# Altium project AD9959.PrjPcb
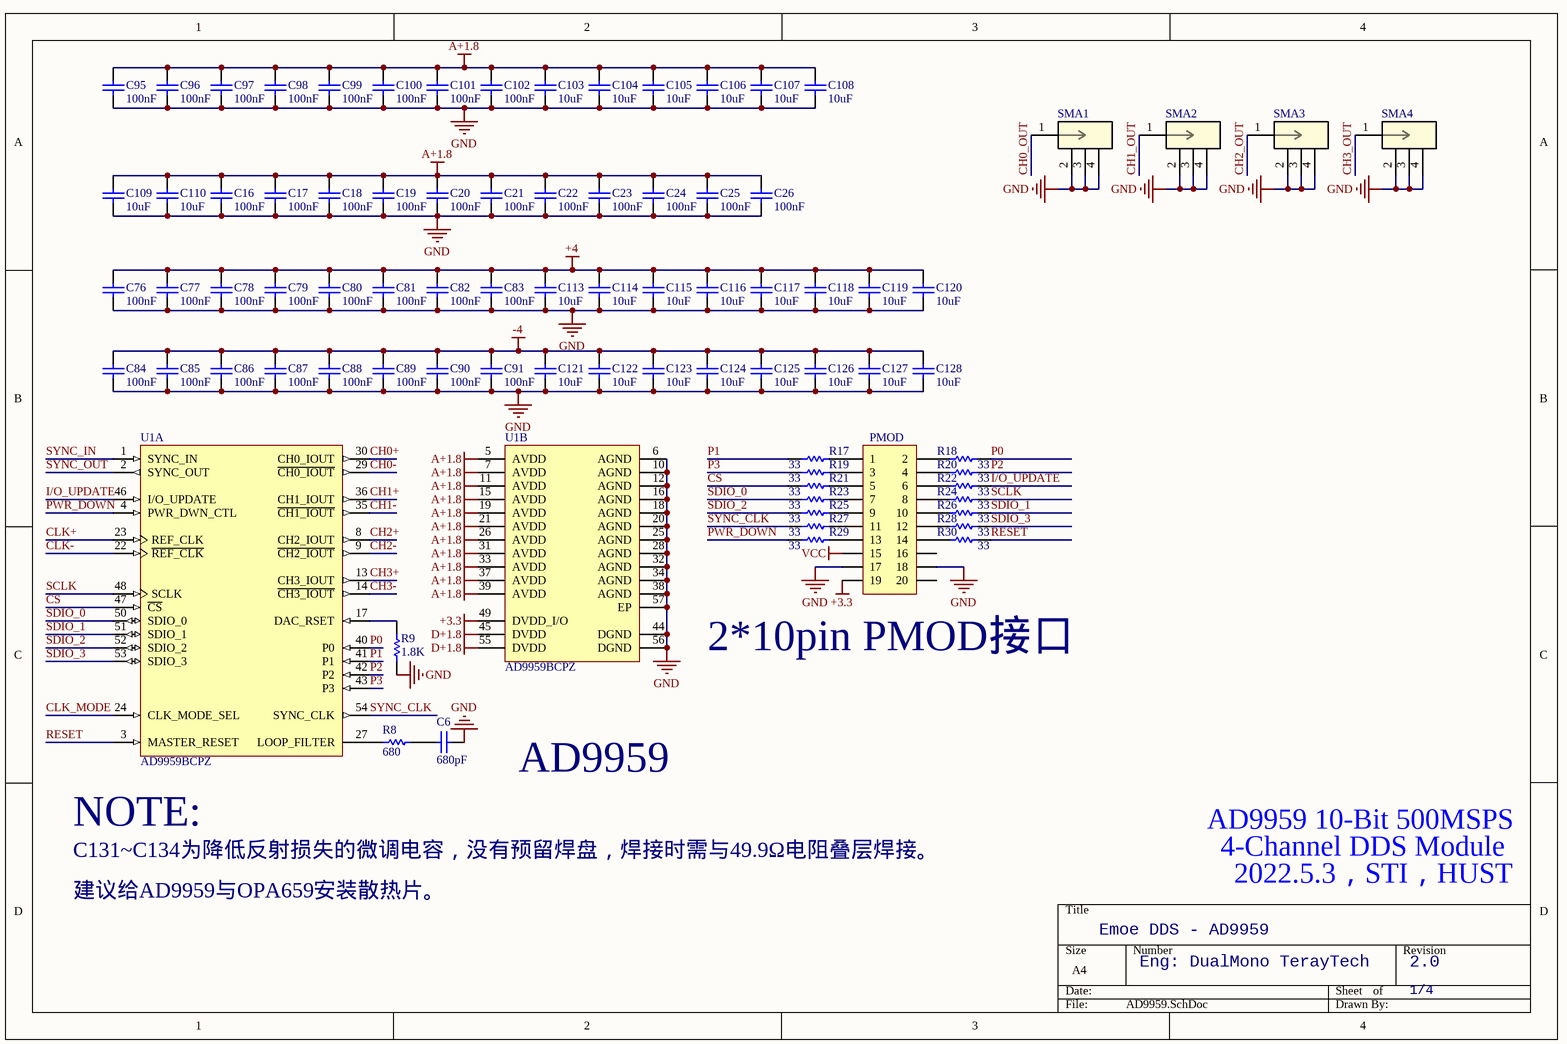
[diagram p0: AD9959.SchDoc]
4 sheets, 274 parts. Net scope: global (net labels, ports and power ports of the same name join across sheets).
Board file: AD9959.PcbDoc
Sheets:
  AD9959.SchDoc
  buffer.SchDoc
  CLOCKING.SchDoc
  power_fix.SchDoc

## Sheet AD9959.SchDoc: AD9959 4-Channel 500M DDS Module
size A4; Date: 2022.4.26; ApprovedBy: Pablo; CheckedBy: Pablo; Author: Pablo; CompanyName: STI; DrawnBy: Pablo; Engineer: Pablo; Organization: STI; DocumentNumber: 1; Revision: 1; SheetNumber: 1; SheetTotal: 4; Time: 2022.4.26

### Parts
C6  680pF  [0402]
C16  100nF  [0402]
C17  100nF  [0402]
C18  100nF  [0402]
C19  100nF  [0402]
C20  100nF  [0402]
C21  100nF  [0402]
C22  100nF  [0402]
C23  100nF  [0402]
C24  100nF  [0402]
C25  100nF  [0402]
C26  100nF  [0402]
C76  100nF  [0402]
C77  100nF  [0402]
C78  100nF  [0402]
C79  100nF  [0402]
C80  100nF  [0402]
C81  100nF  [0402]
C82  100nF  [0402]
C83  100nF  [0402]
C84  100nF  [0402]
C85  100nF  [0402]
C86  100nF  [0402]
C87  100nF  [0402]
C88  100nF  [0402]
C89  100nF  [0402]
C90  100nF  [0402]
C91  100nF  [0402]
C95  100nF  [0402]
C96  100nF  [0402]
C97  100nF  [0402]
C98  100nF  [0402]
C99  100nF  [0402]
C100  100nF  [0402]
C101  100nF  [0402]
C102  100nF  [0402]
C103  10uF  [0402]
C104  10uF  [0402]
C105  10uF  [0402]
C106  10uF  [0402]
C107  10uF  [0402]
C108  10uF  [0402]
C109  10uF  [0402]
C110  10uF  [0402]
C113  10uF  [0402]
C114  10uF  [0402]
C115  10uF  [0402]
C116  10uF  [0402]
C117  10uF  [0402]
C118  10uF  [0402]
C119  10uF  [0402]
C120  10uF  [0402]
C121  10uF  [0402]
C122  10uF  [0402]
C123  10uF  [0402]
C124  10uF  [0402]
C125  10uF  [0402]
C126  10uF  [0402]
C127  10uF  [0402]
C128  10uF  [0402]
PMOD  Header 2X10  [201R2X10]  (value not drawn)
R8  680  [0402]
R9  1.8K  [0402]
R17  33  [0402]
R18  33  [0402]
R19  33  [0402]
R20  33  [0402]
R21  33  [0402]
R22  33  [0402]
R23  33  [0402]
R24  33  [0402]
R25  33  [0402]
R26  33  [0402]
R27  33  [0402]
R28  33  [0402]
R29  33  [0402]
R30  33  [0402]
SMA1  132414  [CONN_132414_AMP]  (value not drawn)
SMA2  132414  [CONN_132414_AMP]  (value not drawn)
SMA3  132414  [CONN_132414_AMP]  (value not drawn)
SMA4  132414  [CONN_132414_AMP]  (value not drawn)
U1  AD9959BCPZ  [ADI-CP-56-1_L]  (parts A,B of 2)

### Nets
+3.3: PMOD.19 U1.49(DVDD_I/O)
+4: C76.1 C77.1 C78.1 C79.1 C80.1 C81.1 C82.1 C83.1 C113.1 C114.1 C115.1 C116.1 C117.1 C118.1 C119.1 C120.1
-4: C84.1 C85.1 C86.1 C87.1 C88.1 C89.1 C90.1 C91.1 C121.1 C122.1 C123.1 C124.1 C125.1 C126.1 C127.1 C128.1
A+1.8: C16.1 C17.1 C18.1 C19.1 C20.1 C21.1 C22.1 C23.1 C24.1 C25.1 C26.1 C95.1 C96.1 C97.1 C98.1 C99.1 C100.1 C101.1 C102.1 C103.1 C104.1 C105.1 C106.1 C107.1 C108.1 C109.1 C110.1 U1.5(AVDD) U1.7(AVDD) U1.11(AVDD) U1.15(AVDD) U1.19(AVDD) U1.21(AVDD) U1.26(AVDD) U1.31(AVDD) U1.33(AVDD) U1.37(AVDD) U1.39(AVDD)
D+1.8: U1.45(DVDD) U1.55(DVDD)
GND: C6.1 C16.2 C17.2 C18.2 C19.2 C20.2 C21.2 C22.2 C23.2 C24.2 C25.2 C26.2 C76.2 C77.2 C78.2 C79.2 C80.2 C81.2 C82.2 C83.2 C84.2 C85.2 C86.2 C87.2 C88.2 C89.2 C90.2 C91.2 C95.2 C96.2 C97.2 C98.2 C99.2 C100.2 C101.2 C102.2 C103.2 C104.2 C105.2 C106.2 C107.2 C108.2 C109.2 C110.2 C113.2 C114.2 C115.2 C116.2 C117.2 C118.2 C119.2 C120.2 C121.2 C122.2 C123.2 C124.2 C125.2 C126.2 C127.2 C128.2 PMOD.17 PMOD.18 R9.2 SMA1.2 SMA1.3 SMA1.4 SMA2.2 SMA2.3 SMA2.4 SMA3.2 SMA3.3 SMA3.4 SMA4.2 SMA4.3 SMA4.4 U1.6(AGND) U1.10(AGND) U1.12(AGND) U1.16(AGND) U1.18(AGND) U1.20(AGND) U1.25(AGND) U1.28(AGND) U1.32(AGND) U1.34(AGND) U1.38(AGND) U1.44(DGND) U1.56(DGND) U1.57(EP)
VCC: PMOD.15
CH0+: U1.30(CH0_IOUT)
CH0-: U1.29(~{CH0_IOUT})
CH0_OUT: SMA1.1
CH1+: U1.36(CH1_IOUT)
CH1-: U1.35(~{CH1_IOUT})
CH1_OUT: SMA2.1
CH2+: U1.8(CH2_IOUT)
CH2-: U1.9(~{CH2_IOUT})
CH2_OUT: SMA3.1
CH3+: U1.13(CH3_IOUT)
CH3-: U1.14(~{CH3_IOUT})
CH3_OUT: SMA4.1
CLK+: U1.23(REF_CLK)
CLK-: U1.22(~{REF_CLK})
CLK_MODE: U1.24(CLK_MODE_SEL)
CS: R21.2 U1.47(~{CS})
I/O_UPDATE: R22.1 U1.46(I/O_UPDATE)
P0: R18.1 U1.40(P0)
P1: R17.2 U1.41(P1)
P2: R20.1 U1.42(P2)
P3: R19.2 U1.43(P3)
PWR_DOWN: R29.2 U1.4(PWR_DWN_CTL)
RESET: R30.1 U1.3(MASTER_RESET)
SCLK: R24.1 U1.48(SCLK)
SDIO_0: R23.2 U1.50(SDIO_0)
SDIO_1: R26.1 U1.51(SDIO_1)
SDIO_2: R25.2 U1.52(SDIO_2)
SDIO_3: R28.1 U1.53(SDIO_3)
SYNC_CLK: R27.2 U1.54(SYNC_CLK)
SYNC_IN: U1.1(SYNC_IN)
SYNC_OUT: U1.2(SYNC_OUT)
NetC6_2: C6.2 R8.2
NetPMOD_1: PMOD.1 R17.1
NetPMOD_2: PMOD.2 R18.2
NetPMOD_3: PMOD.3 R19.1
NetPMOD_4: PMOD.4 R20.2
NetPMOD_5: PMOD.5 R21.1
NetPMOD_6: PMOD.6 R22.2
NetPMOD_7: PMOD.7 R23.1
NetPMOD_8: PMOD.8 R24.2
NetPMOD_9: PMOD.9 R25.1
NetPMOD_10: PMOD.10 R26.2
NetPMOD_11: PMOD.11 R27.1
NetPMOD_12: PMOD.12 R28.2
NetPMOD_13: PMOD.13 R29.1
NetPMOD_14: PMOD.14 R30.2
NetR8_1: R8.1 U1.27(LOOP_FILTER)
NetR9_1: R9.1 U1.17(DAC_RSET)

Not connected (* = marked no-connect by the designer): PMOD 16 20

### Notes on the sheet
- (near PMOD) 2*10pin PMOD接口
- AD9959
- (near U1) NOTE:
- C131~C134为降低反射损失的微调电容，没有预留焊盘，焊接时需与49.9Ω电阻叠层焊接。
- AD9959 10-Bit 500MSPS
- 4-Channel DDS Module
- 建议给AD9959与OPA659安装散热片。
- Emoe DDS - AD9959
- 2022.5.3，STI，HUST
- Eng: DualMono TerayTech
- 2.0
- 1/4
- Title:
- Size:
- Date:
- A4
- No.:
- Sheet           of
- Revision:
- Author:
- File:

### Library data of the parts
C6 C16-C26 C76-C91 C95-C110 C113-C128 = CAP: Capacitor; Value: 104; Published: 8-Jun-2000; LatestRevisionDate: 17-Jul-2002; LatestRevisionNote: Re-released for DXP Platform.; PackageReference: RAD-0.3; Publisher: Altium Limited
PMOD = Header 10X2: 10*2P接插件; 淘宝ID: 小糖豆的小窝窝; BOM名称: 10*2P接插件; 下单链接: https://item.taobao.com/item.htm?ft=t&id=613637044352
R8 R9 R17-R30 = RES: Resistor; Value: 1K; Published: 8-Jun-2000; Revision: July-2002: Re-released for DXP Platform.; Publisher: Altium Limited
SMA1-SMA4 = 132414: No Description Available; Mfr_Name: Amphenol ICC; Copyright: Copyright (C) 2022 Ultra Librarian. All rights reserved.; Manufacturer_Part_Number: 132414; RefDes: RefDes; Type: DEV
U1 = CMP-0293-00014-1: 4-Channel, 500 MSPS DDS with 10-Bit DACs, Serial, CP-56-1, 260 Tray, Pb-Free; Tuning Word Width (bits): 32bit; Master fclk: 500MHz; Compliance Range (V): 2.3V; FS Iout (mA nom): 10mA; REFCLK Multiplier: Yes; I Supply total (max): 180mA; Resolution (Bits): 10bit; ComponentLink3URL: http://www.analog.com/static/imported-files/packages/32698137492825CP_56_1.pdf; PackageDescription: 56-Lead Lead Frame Chip Scale Package [LFCSP_VQ]; DatasheetVersion: Rev. B; ComponentLink1URL: www.analog.com; PackageVersion: 112805-0; ComponentLink1Description: Manufacturer URL; ComponentLink2Description: Datasheet; Code_JEDEC: MO-220-VLLD-2; ComponentLink2URL: http://www.analog.com/static/imported-files/data_sheets/AD9959.pdf; PackageReference: CP-56-1; I/O Interface: Serial; ComponentLink3Description: Package Specification

## Sheet buffer.SchDoc
size A4; SheetNumber: 2; SheetTotal: 4
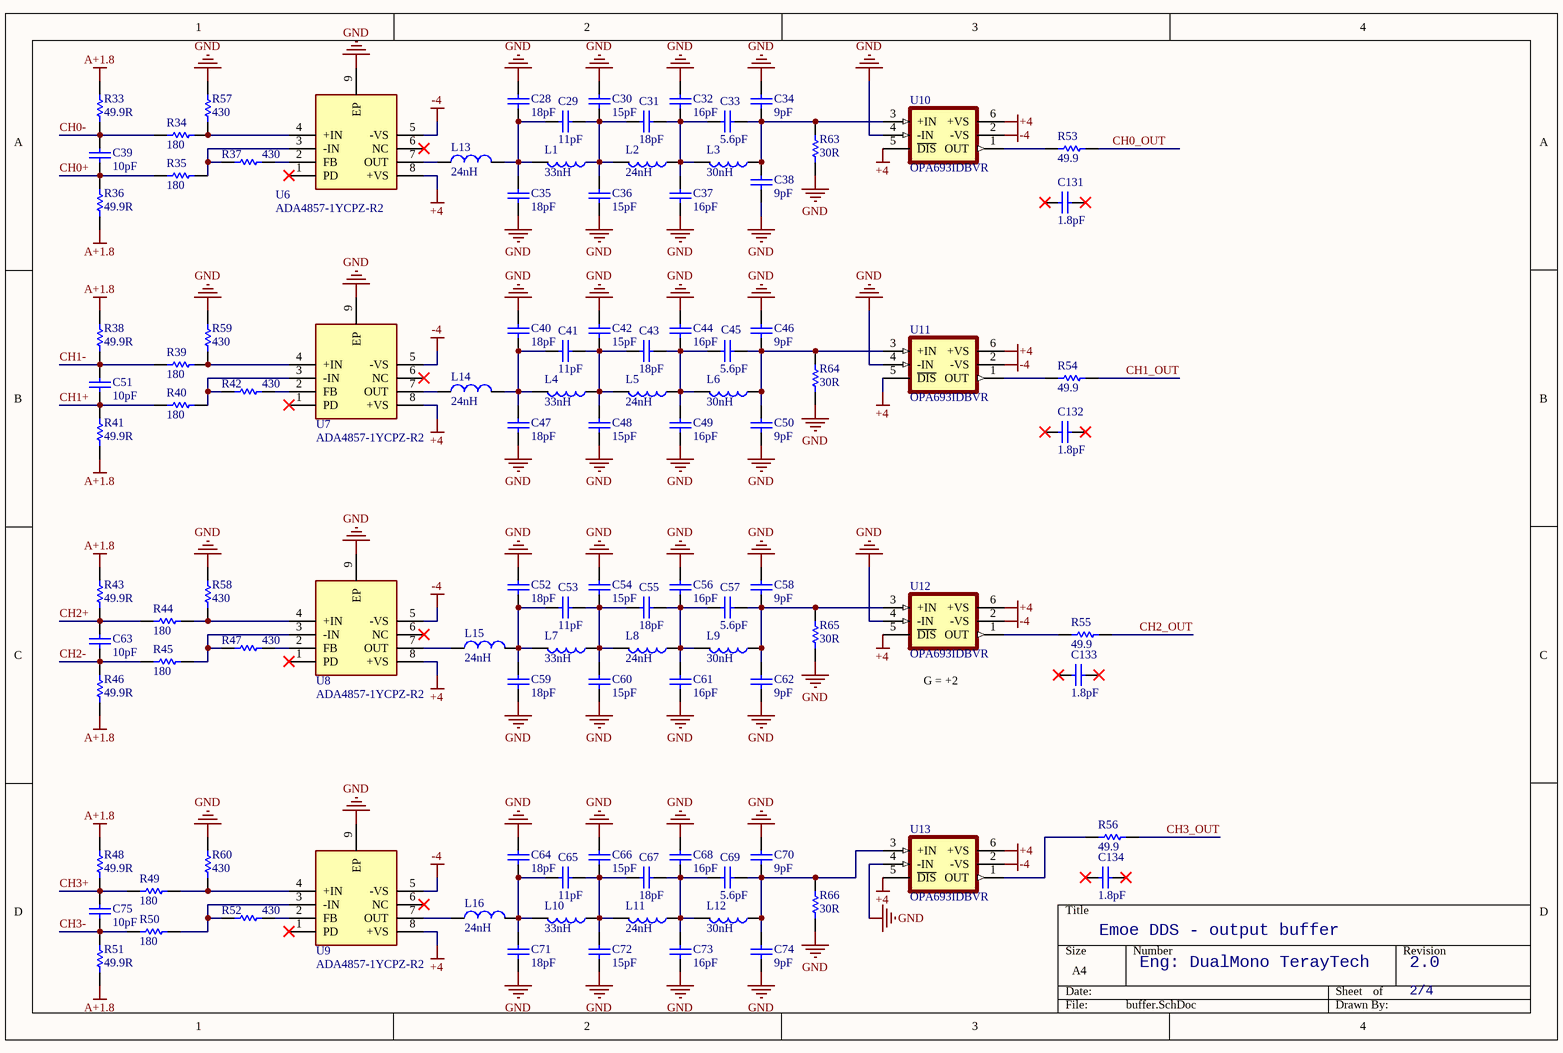
[diagram p1: buffer.SchDoc]

### Parts
C28  18pF  [0402]
C29  11pF  [0402]
C30  15pF  [0402]
C31  18pF  [0402]
C32  16pF  [0402]
C33  5.6pF  [0402]
C34  9pF  [0402]
C35  18pF  [0402]
C36  15pF  [0402]
C37  16pF  [0402]
C38  9pF  [0402]
C39  10pF  [0402]
C40  18pF  [0402]
C41  11pF  [0402]
C42  15pF  [0402]
C43  18pF  [0402]
C44  16pF  [0402]
C45  5.6pF  [0402]
C46  9pF  [0402]
C47  18pF  [0402]
C48  15pF  [0402]
C49  16pF  [0402]
C50  9pF  [0402]
C51  10pF  [0402]
C52  18pF  [0402]
C53  11pF  [0402]
C54  15pF  [0402]
C55  18pF  [0402]
C56  16pF  [0402]
C57  5.6pF  [0402]
C58  9pF  [0402]
C59  18pF  [0402]
C60  15pF  [0402]
C61  16pF  [0402]
C62  9pF  [0402]
C63  10pF  [0402]
C64  18pF  [0402]
C65  11pF  [0402]
C66  15pF  [0402]
C67  18pF  [0402]
C68  16pF  [0402]
C69  5.6pF  [0402]
C70  9pF  [0402]
C71  18pF  [0402]
C72  15pF  [0402]
C73  16pF  [0402]
C74  9pF  [0402]
C75  10pF  [0402]
C131  1.8pF  [0402]
C132  1.8pF  [0402]
C133  1.8pF  [0402]
C134  1.8pF  [0402]
L1  33nH  [0402]
L2  24nH  [0402]
L3  30nH  [0402]
L4  33nH  [0402]
L5  24nH  [0402]
L6  30nH  [0402]
L7  33nH  [0402]
L8  24nH  [0402]
L9  30nH  [0402]
L10  33nH  [0402]
L11  24nH  [0402]
L12  30nH  [0402]
L13  24nH  [0402L]
L14  24nH  [0402L]
L15  24nH  [0402L]
L16  24nH  [0402L]
R33  49.9R  [0402]
R34  180  [0402]
R35  180  [0402]
R36  49.9R  [0402]
R37  430  [0402]
R38  49.9R  [0402]
R39  180  [0402]
R40  180  [0402]
R41  49.9R  [0402]
R42  430  [0402]
R43  49.9R  [0402]
R44  180  [0402]
R45  180  [0402]
R46  49.9R  [0402]
R47  430  [0402]
R48  49.9R  [0402]
R49  180  [0402]
R50  180  [0402]
R51  49.9R  [0402]
R52  430  [0402]
R53  49.9  [0603]
R54  49.9  [0603]
R55  49.9  [0603]
R56  49.9  [0603]
R57  430  [0402]
R58  430  [0402]
R59  430  [0402]
R60  430  [0402]
R63  30R  [0402L]
R64  30R  [0402L]
R65  30R  [0402L]
R66  30R  [0402L]
U6  ADA4857-1YCPZ-R2  [SON50P300X300X85-9N-D]
U7  ADA4857-1YCPZ-R2  [SON50P300X300X85-9N-D]
U8  ADA4857-1YCPZ-R2  [SON50P300X300X85-9N-D]
U9  ADA4857-1YCPZ-R2  [SON50P300X300X85-9N-D]
U10  OPA693IDBVR  [SOT95P280X145-6N]
U11  OPA693IDBVR  [SOT95P280X145-6N]
U12  OPA693IDBVR  [SOT95P280X145-6N]
U13  OPA693IDBVR  [SOT95P280X145-6N]

### Nets
+4: U6.8(+VS) U7.8(+VS) U8.8(+VS) U9.8(+VS) U10.5(~{DIS}) U10.6(+VS) U11.5(~{DIS}) U11.6(+VS) U12.5(~{DIS}) U12.6(+VS) U13.5(~{DIS}) U13.6(+VS)
-4: U6.5(-VS) U7.5(-VS) U8.5(-VS) U9.5(-VS) U10.2(-VS) U11.2(-VS) U12.2(-VS) U13.2(-VS)
A+1.8: R33.1 R36.2 R38.1 R41.2 R43.1 R46.2 R48.1 R51.2
GND: C28.1 C30.1 C32.1 C34.2 C35.2 C36.2 C37.2 C38.1 C40.1 C42.1 C44.1 C46.2 C47.2 C48.2 C49.2 C50.1 C52.1 C54.1 C56.1 C58.2 C59.2 C60.2 C61.2 C62.1 C64.1 C66.1 C68.1 C70.2 C71.2 C72.2 C73.2 C74.1 R57.2 R58.2 R59.2 R60.2 R63.1 R64.1 R65.1 R66.1 U6.9(EP) U7.9(EP) U8.9(EP) U9.9(EP) U10.4(-IN) U11.4(-IN) U12.4(-IN) U13.4(-IN)
CH0+: C39.1 R35.1 R36.1
CH0-: C39.2 R33.2 R34.1
CH0_OUT: R53.2
CH1+: C51.1 R40.1 R41.1
CH1-: C51.2 R38.2 R39.1
CH1_OUT: R54.2
CH2+: C63.2 R43.2 R44.1
CH2-: C63.1 R45.1 R46.1
CH2_OUT: R55.2
CH3+: C75.2 R48.2 R49.1
CH3-: C75.1 R50.1 R51.1
CH3_OUT: R56.2
NetC28_2: C28.2 C29.1 C35.1 L1.2 L13.2
NetC29_2: C29.2 C30.2 C31.1 C36.1 L1.1 L2.2
NetC31_2: C31.2 C32.2 C33.1 C37.1 L2.1 L3.2
NetC33_2: C33.2 C34.1 C38.2 L3.1 R63.2 U10.3(+IN)
NetC40_2: C40.2 C41.1 C47.1 L4.2 L14.2
NetC41_2: C41.2 C42.2 C43.1 C48.1 L4.1 L5.2
NetC43_2: C43.2 C44.2 C45.1 C49.1 L5.1 L6.2
NetC45_2: C45.2 C46.1 C50.2 L6.1 R64.2 U11.3(+IN)
NetC52_2: C52.2 C53.1 C59.1 L7.2 L15.2
NetC53_2: C53.2 C54.2 C55.1 C60.1 L7.1 L8.2
NetC55_2: C55.2 C56.2 C57.1 C61.1 L8.1 L9.2
NetC57_2: C57.2 C58.1 C62.2 L9.1 R65.2 U12.3(+IN)
NetC64_2: C64.2 C65.1 C71.1 L10.2 L16.2
NetC65_2: C65.2 C66.2 C67.1 C72.1 L10.1 L11.2
NetC67_2: C67.2 C68.2 C69.1 C73.1 L11.1 L12.2
NetC69_2: C69.2 C70.1 C74.2 L12.1 R66.2 U13.3(+IN)
NetL13_1: L13.1 U6.7(OUT)
NetL14_1: L14.1 U7.7(OUT)
NetL15_1: L15.1 U8.7(OUT)
NetL16_1: L16.1 U9.7(OUT)
NetR34_2: R34.2 R57.1 U6.4(+IN)
NetR35_2: R35.2 R37.1 U6.3(-IN)
NetR37_2: R37.2 U6.2(FB)
NetR39_2: R39.2 R59.1 U7.4(+IN)
NetR40_2: R40.2 R42.1 U7.3(-IN)
NetR42_2: R42.2 U7.2(FB)
NetR44_2: R44.2 R58.1 U8.4(+IN)
NetR45_2: R45.2 R47.1 U8.3(-IN)
NetR47_2: R47.2 U8.2(FB)
NetR49_2: R49.2 R60.1 U9.4(+IN)
NetR50_2: R50.2 R52.1 U9.3(-IN)
NetR52_2: R52.2 U9.2(FB)
NetR53_1: R53.1 U10.1(OUT)
NetR54_1: R54.1 U11.1(OUT)
NetR55_1: R55.1 U12.1(OUT)
NetR56_1: R56.1 U13.1(OUT)

Not connected (* = marked no-connect by the designer): C131 1* 2*; C132 1* 2*; C133 1* 2*; C134 1* 2*; U6 1(PD)* 6(NC)*; U7 1(PD)* 6(NC)*; U8 1(PD)* 6(NC)*; U9 1(PD)* 6(NC)*

### Notes on the sheet
- (near U12) G = +2
- (near C134) Emoe DDS - output buffer
- Eng: DualMono TerayTech
- 2.0
- 2/4

### Library data of the parts
C28-C75 C131-C134 = CAP: Capacitor; Value: 104; Published: 8-Jun-2000; LatestRevisionDate: 17-Jul-2002; LatestRevisionNote: Re-released for DXP Platform.; PackageReference: RAD-0.3; Publisher: Altium Limited
L1-L12 = FB
L13-L16 = Inductor
R33-R60 R63-R66 = RES: Resistor; Value: 1K; Published: 8-Jun-2000; Revision: July-2002: Re-released for DXP Platform.; Publisher: Altium Limited
U6-U9 = ADA4857-1YCPZ-R2: Integrated Circuit; Manufacturer_Name: Analog Devices; Datasheet Link: https://g.componentsearchengine.com/Datasheets/1/ADA4857-1YCPZ-R2.pdf; Height: 0.85mm; Manufacturer_Part_Number: ADA4857-1YCPZ-R2; Mouser Part Number: 584-ADA4857-1YCPZ-R2; Mouser Price/Stock: http://www.mouser.com/Search/ProductDetail.aspx?qs=pqQDoYZ2quYEvaTEvq9xqQ%3d%3d
U10-U13 = OPA693IDBVR: Ultra-Wideband, Fixed Gain Video Buffer Amplifier with Disable; MF: Texas Instruments; Availability: In Stock; Package: SOT-23-6 Texas Instruments; MP: OPA693IDBVR; Value: *; Purchase-URL: https://pricing.snapeda.com/search/part/OPA693IDBVR/?ref=eda; SnapEDA_Link: https://www.snapeda.com/parts/OPA693IDBVR/Texas+Instruments/view-part/?ref=snap; Price: None; Check_prices: https://www.snapeda.com/parts/OPA693IDBVR/Texas+Instruments/view-part/?ref=eda

## Sheet CLOCKING.SchDoc
size A4; SheetNumber: 3; SheetTotal: 4
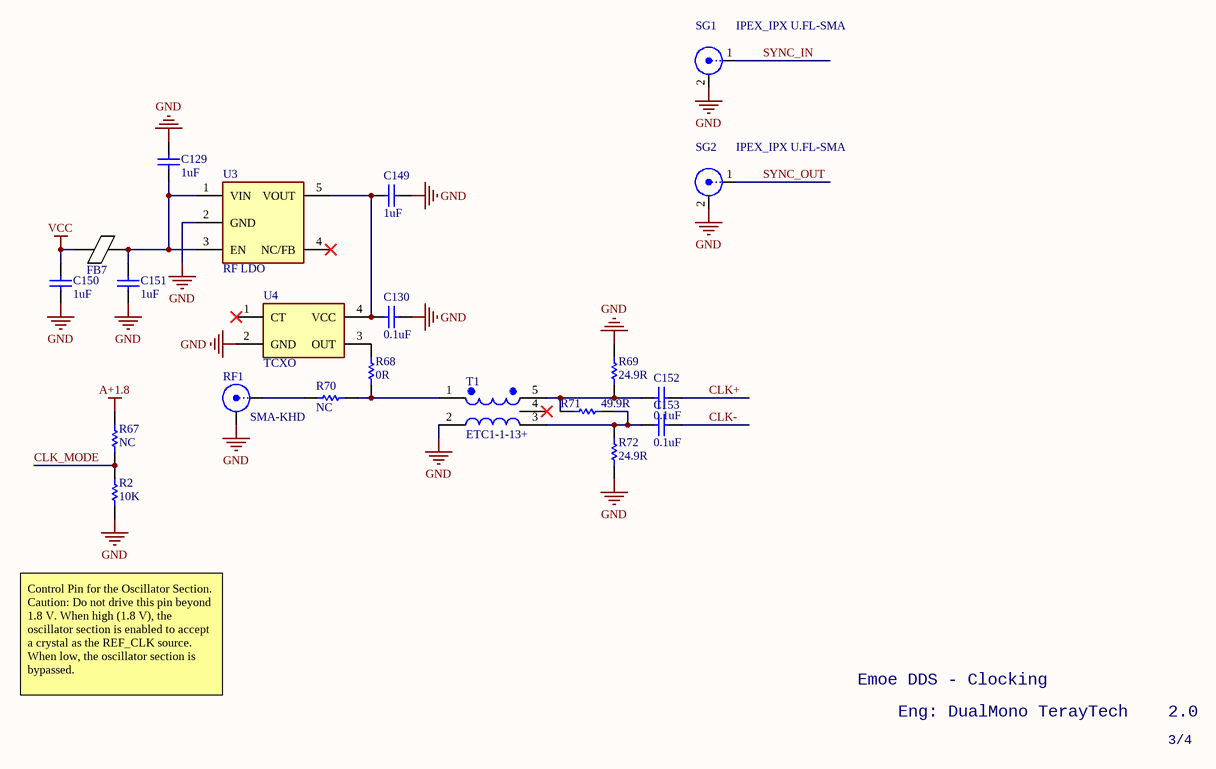
[diagram p2: CLOCKING.SchDoc]

### Parts
C129  1uF  [0603_C]
C130  0.1uF  [0402]
C149  1uF  [0603_C]
C150  1uF  [0603_C]
C151  1uF  [0603_C]
C152  0.1uF  [0402l]
C153  0.1uF  [0402l]
FB7  600Ω @ 100MHz  [0603]  (value not drawn)
R2  10K  [0402]
R67  NC  [0402L]
R68  0R  [0402]
R69  24.9R  [0402L]
R70  NC  [0402]
R71  49.9R  [0402L]
R72  24.9R  [0402L]
RF1  SMA-KHD  [SMA-5]
SG1  IPEX_IPX U.FL-SMA  [IPEX_gen1]
SG2  IPEX_IPX U.FL-SMA  [IPEX_gen1]
T1  ETC1-1-13+  [BALUN-5]
U3  RF LDO  [SOT-23-5]
U4  TCXO  [OSC_KH3225_4P]

### Nets
A+1.8: R67.1
GND: C129.1 C130.2 C149.1 C150.1 C151.1 R2.2 R69.1 R72.1 RF1.1 SG1.2(GND) SG2.2(GND) T1.2 U3.2(GND) U4.2(GND)
VCC: C150.2 FB7.1
CLK+: C152.2
CLK-: C153.2
CLK_MODE: R2.1 R67.2
SYNC_IN: SG1.1(X)
SYNC_OUT: SG2.1(X)
NetC129_2: C129.2 C151.2 FB7.2 U3.1(VIN) U3.3(EN)
NetC130_1: C130.1 C149.2 U3.5(VOUT) U4.4(VCC)
NetC152_1: C152.1 R69.2 R71.1 T1.5
NetC153_1: C153.1 R71.2 R72.2 T1.3
NetR68_1: R68.1 U4.3(OUT)
NetR68_2: R68.2 R70.2 T1.1
NetR70_1: R70.1 RF1.2

Not connected (* = marked no-connect by the designer): T1 4*; U3 4(NC/FB)*; U4 1(CT)*

### Notes on the sheet
- Emoe DDS - Clocking
- Control Pin for the Oscillator Section. Caution: Do not drive this pin beyond 1.8 V. When high (1.8 V), the oscillator section is enabled to accept a crystal as the REF_CLK source. When low, the oscillator section is bypassed.
- Eng: DualMono TerayTech
- 2.0
- 3/4

### Library data of the parts
C129 C130 C149-C153 = CAP: Capacitor; Value: 104; Published: 8-Jun-2000; LatestRevisionDate: 17-Jul-2002; LatestRevisionNote: Re-released for DXP Platform.; PackageReference: RAD-0.3; Publisher: Altium Limited
FB7 = FB: 磁珠 600Ω @ 100MHz
R2 R67-R72 = RES: Resistor; Value: 1K; Published: 8-Jun-2000; Revision: July-2002: Re-released for DXP Platform.; Publisher: Altium Limited
RF1 = SMA_KHD
T1 = ETC1-1-13
U3 = ADP150

## Sheet power_fix.SchDoc
size A4; SheetNumber: 4; SheetTotal: 4
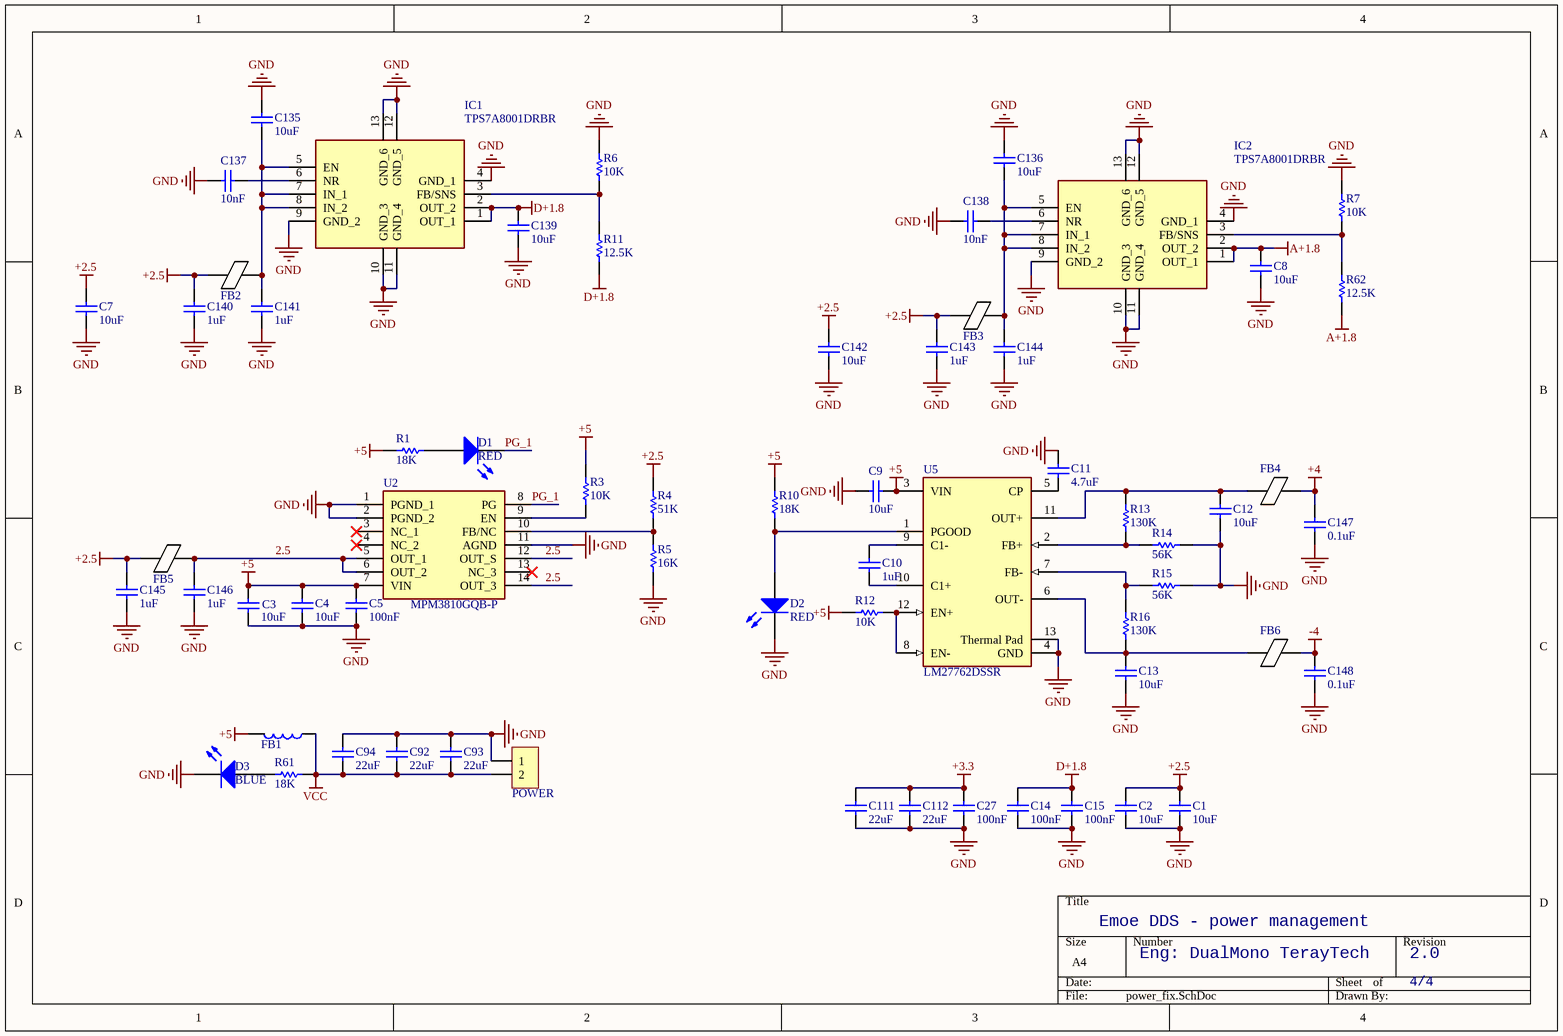
[diagram p3: power_fix.SchDoc]

### Parts
C1  10uF  [1608[0603]]
C2  10uF  [1608[0603]]
C3  10uF  [1608[0603]]
C4  10uF  [1608[0603]]
C5  100nF  [0402]
C7  10uF  [1608[0603]]
C8  10uF  [0603_C]
C9  10uF  [1608[0603]]
C10  1uF  [0402]
C11  4.7uF  [1608[0603]]
C12  10uF  [1608[0603]]
C13  10uF  [1608[0603]]
C14  100nF  [0402]
C15  100nF  [0402]
C27  100nF  [0402]
C92  22uF  [6-0805_L]
C93  22uF  [6-0805_L]
C94  22uF  [6-0805_L]
C111  22uF  [6-0805_L]
C112  22uF  [6-0805_L]
C135  10uF  [0603_C]
C136  10uF  [0603_C]
C137  10nF  [0402L]
C138  10nF  [0402L]
C139  10uF  [0603_C]
C140  1uF  [0603_C]
C141  1uF  [0603_C]
C142  10uF  [0603_C]
C143  1uF  [0603_C]
C144  1uF  [0603_C]
C145  1uF  [0603_C]
C146  1uF  [0603_C]
C147  0.1uF  [0603_C]
C148  0.1uF  [0603_C]
D1  RED  [1608[0603]]
D2  RED  [1608[0603]]
D3  BLUE  [1608[0603]]
FB1  100R,100MHz, 0603  [1608[0603]]  (value not drawn)
FB2  600Ω @ 100MHz  [0603]  (value not drawn)
FB3  600Ω @ 100MHz  [0603]  (value not drawn)
FB4  600Ω @ 100MHz  [0603]  (value not drawn)
FB5  600Ω @ 100MHz  [0603]  (value not drawn)
FB6  600Ω @ 100MHz  [0603]  (value not drawn)
IC1  TPS7A8001DRBR  [TPS7A8001DRBR]
IC2  TPS7A8001DRBR  [TPS7A8001DRBR]
POWER  HDR-1X2  [KF2510-LI-2P]  (value not drawn)
R1  18K  [0402]
R3  10K  [0402]
R4  51K  [0402]
R5  16K  [0402]
R6  10K  [0402L]
R7  10K  [0402L]
R10  18K  [0402]
R11  12.5K  [0402L]
R12  10K  [0402]
R13  130K  [0402]
R14  56K  [0402]
R15  56K  [0402]
R16  130K  [0402]
R61  18K  [0402]
R62  12.5K  [0402L]
U2  MPM3810GQB-P  [MPM3810GQB33Z]
U5  LM27762DSSR  [FP-DSS0012B-IPC_A]

### Nets
+2.5: C1.2 C2.2 C7.1 C140.2 C142.2 C143.2 C145.2 FB2.1 FB3.1 FB5.1 R4.2
+3.3: C27.1 C111.1 C112.1
+4: C147.2 FB4.1
+5: C3.1 C4.1 C5.1 C9.2 FB1.2 R1.2 R3.2 R10.2 R12.1 U2.7(VIN) U5.3(VIN)
-4: C148.2 FB6.1
A+1.8: C8.2 IC2.1(OUT_1) IC2.2(OUT_2) R62.1
D+1.8: C14.1 C15.1 C139.2 IC1.1(OUT_1) IC1.2(OUT_2) R11.1
GND: C1.1 C2.1 C3.2 C4.2 C5.2 C7.2 C8.1 C9.1 C11.2 C12.2 C13.1 C14.2 C15.2 C27.2 C92.2 C93.2 C94.2 C111.2 C112.2 C135.1 C136.1 C137.1 C138.1 C139.1 C140.1 C141.1 C142.1 C143.1 C144.1 C145.1 C146.1 C147.1 C148.1 D2.2(K) D3.2(K) IC1.4(GND_1) IC1.9(GND_2) IC1.10(GND_3) IC1.11(GND_4) IC1.12(GND_5) IC1.13(GND_6) IC2.4(GND_1) IC2.9(GND_2) IC2.10(GND_3) IC2.11(GND_4) IC2.12(GND_5) IC2.13(GND_6) POWER.1 R5.1 R6.2 R7.2 R14.1 R15.1 U2.1(PGND_1) U2.2(PGND_2) U2.11(AGND) U5.4(GND) U5.13(Thermal_Pad)
VCC: C92.1 C93.1 C94.1 FB1.1 POWER.2 R61.1
2.5: C146.2 FB5.2 U2.5(OUT_1) U2.6(OUT_2) U2.12(OUT_S) U2.14(OUT_3)
PG_1: D1.2(K) U2.8(PG)
NetC10_1: C10.1 U5.10(C1+)
NetC10_2: C10.2 U5.9(C1-)
NetC11_1: C11.1 U5.5(CP)
NetC12_1: C12.1 FB4.2 R13.1 U5.11(OUT+)
NetC13_2: C13.2 FB6.2 R16.2 U5.6(OUT-)
NetC135_2: C135.2 C141.2 FB2.2 IC1.5(EN) IC1.7(IN_1) IC1.8(IN_2)
NetC136_2: C136.2 C144.2 FB3.2 IC2.5(EN) IC2.7(IN_1) IC2.8(IN_2)
NetC137_2: C137.2 IC1.6(NR)
NetC138_2: C138.2 IC2.6(NR)
NetD1_1: D1.1(A) R1.1
NetD2_1: D2.1(A) R10.1 U5.1(PGOOD)
NetD3_1: D3.1(A) R61.2
NetIC1_3: IC1.3(FB/SNS) R6.1 R11.2
NetIC2_3: IC2.3(FB/SNS) R7.1 R62.2
NetR3_1: R3.1 U2.9(EN)
NetR4_1: R4.1 R5.2 U2.10(FB/NC)
NetR12_2: R12.2 U5.8(EN-) U5.12(EN+)
NetR13_2: R13.2 R14.2 U5.2(FB+)
NetR15_2: R15.2 R16.1 U5.7(FB-)

Not connected (* = marked no-connect by the designer): U2 3(NC_1)* 4(NC_2)* 13(NC_3)*

### Notes on the sheet
- Emoe DDS - power management
- Eng: DualMono TerayTech
- 2.0
- 4/4

### Library data of the parts
C1-C5 C7-C15 C27 C92-C94 C111 C112 C135-C148 = CAP: Capacitor; Value: 104; Published: 8-Jun-2000; LatestRevisionDate: 17-Jul-2002; LatestRevisionNote: Re-released for DXP Platform.; PackageReference: RAD-0.3; Publisher: Altium Limited
D1-D3 = LED0: Typical INFRARED GaAs LED; Published: 8-Jun-2000; LatestRevisionDate: 08-Jul-2005; LatestRevisionNote: Mech Layer 1 removed.; PackageReference: LED-0; Publisher: Altium Limited; PackageDescription: LED; 2 Leads
FB1 = FB: 磁珠
FB2-FB6 = FB: 磁珠 600Ω @ 100MHz
IC1 IC2 = TPS7A8001DRBR: Integrated Circuit; Manufacturer_Name: Texas Instruments; Datasheet Link: https://datasheet.lcsc.com/szlcsc/Texas-Instruments-TI-TPS7A8001DRBR_C105265.pdf; Height: 1mm; Manufacturer_Part_Number: TPS7A8001DRBR; Mouser Part Number: 595-TPS7A8001DRBR; Mouser Price/Stock: https://www.mouser.co.uk/ProductDetail/Texas-Instruments/TPS7A8001DRBR?qs=CLImetaeaXWznukkeYNGNw%3D%3D; Arrow Part Number: TPS7A8001DRBR; Arrow Price/Stock: https://www.arrow.com/en/products/tps7a8001drbr/texas-instruments?region=nac
POWER = Header 2: 2P接插件; 淘宝ID: 小糖豆的小窝窝; BOM名称: 2P接插件; 下单链接: https://item.taobao.com/item.htm?ft=t&id=613637044352
R1 R3-R7 R10-R16 R61 R62 = RES: Resistor; Value: 1K; Published: 8-Jun-2000; Revision: July-2002: Re-released for DXP Platform.; Publisher: Altium Limited
U2 = MPM3810GQB-P: Integrated Circuit; Manufacturer_Name: Monolithic Power Systems (MPS); Datasheet Link: https://www.monolithicpower.com/pub/media/document/MPM3810_r1.1.pdf; Height: 1mm; Manufacturer_Part_Number: MPM3810GQB-P; Mouser Part Number: 946-MPM3810GQBP; Mouser Price/Stock: https://www.mouser.co.uk/ProductDetail/Monolithic-Power-Systems-MPS/MPM3810GQB-P?qs=QEkzKklKf2S%252BUubfiGImEA%3D%3D
U5 = CMP-04918-000139-2: IC REG CHARGE PUMP ADJ DL 12WSON; Min Output Voltage: 1.5V; Max Input Voltage: 5.5V; Synchronous Rectifier: No; Output Type: Adjustable; Output Current: 250mA; Min Input Voltage: 2.7V; Quiescent Current: 390uA; Switching Frequency: 2.3MHz; Max Output Voltage: 5V; Topology: Charge Pump; Lead Free: Lead Free; Min Operating Temperature: -40°C; Max Operating Temperature: 85°C; RoHS Compliant: Yes; Packaging: Tape and Reel; Mount: Surface Mount

## Nets that join several sheets
+3.3: AD9959 (PMOD.19 U1.49), power_fix (C27.1 C111.1 C112.1)
+4: AD9959 (16 pins), buffer (12 pins), power_fix (C147.2 FB4.1)
-4: AD9959 (16 pins), buffer (8 pins), power_fix (C148.2 FB6.1)
A+1.8: AD9959 (38 pins), buffer (8 pins), CLOCKING (R67.1), power_fix (C8.2 IC2.1 IC2.2 R62.1)
D+1.8: AD9959 (U1.45 U1.55), power_fix (6 pins)
GND: AD9959 (89 pins), buffer (48 pins), CLOCKING (14 pins), power_fix (58 pins)
VCC: AD9959 (PMOD.15), CLOCKING (C150.2 FB7.1), power_fix (6 pins)
CH0+: AD9959 (U1.30), buffer (C39.1 R35.1 R36.1)
CH0-: AD9959 (U1.29), buffer (C39.2 R33.2 R34.1)
CH0_OUT: AD9959 (SMA1.1), buffer (R53.2)
CH1+: AD9959 (U1.36), buffer (C51.1 R40.1 R41.1)
CH1-: AD9959 (U1.35), buffer (C51.2 R38.2 R39.1)
CH1_OUT: AD9959 (SMA2.1), buffer (R54.2)
CH2+: AD9959 (U1.8), buffer (C63.2 R43.2 R44.1)
CH2-: AD9959 (U1.9), buffer (C63.1 R45.1 R46.1)
CH2_OUT: AD9959 (SMA3.1), buffer (R55.2)
CH3+: AD9959 (U1.13), buffer (C75.2 R48.2 R49.1)
CH3-: AD9959 (U1.14), buffer (C75.1 R50.1 R51.1)
CH3_OUT: AD9959 (SMA4.1), buffer (R56.2)
CLK+: AD9959 (U1.23), CLOCKING (C152.2)
CLK-: AD9959 (U1.22), CLOCKING (C153.2)
CLK_MODE: AD9959 (U1.24), CLOCKING (R2.1 R67.2)
SYNC_IN: AD9959 (U1.1), CLOCKING (SG1.1)
SYNC_OUT: AD9959 (U1.2), CLOCKING (SG2.1)